# EAGLE schematic cnc (EAGLE 6.4)
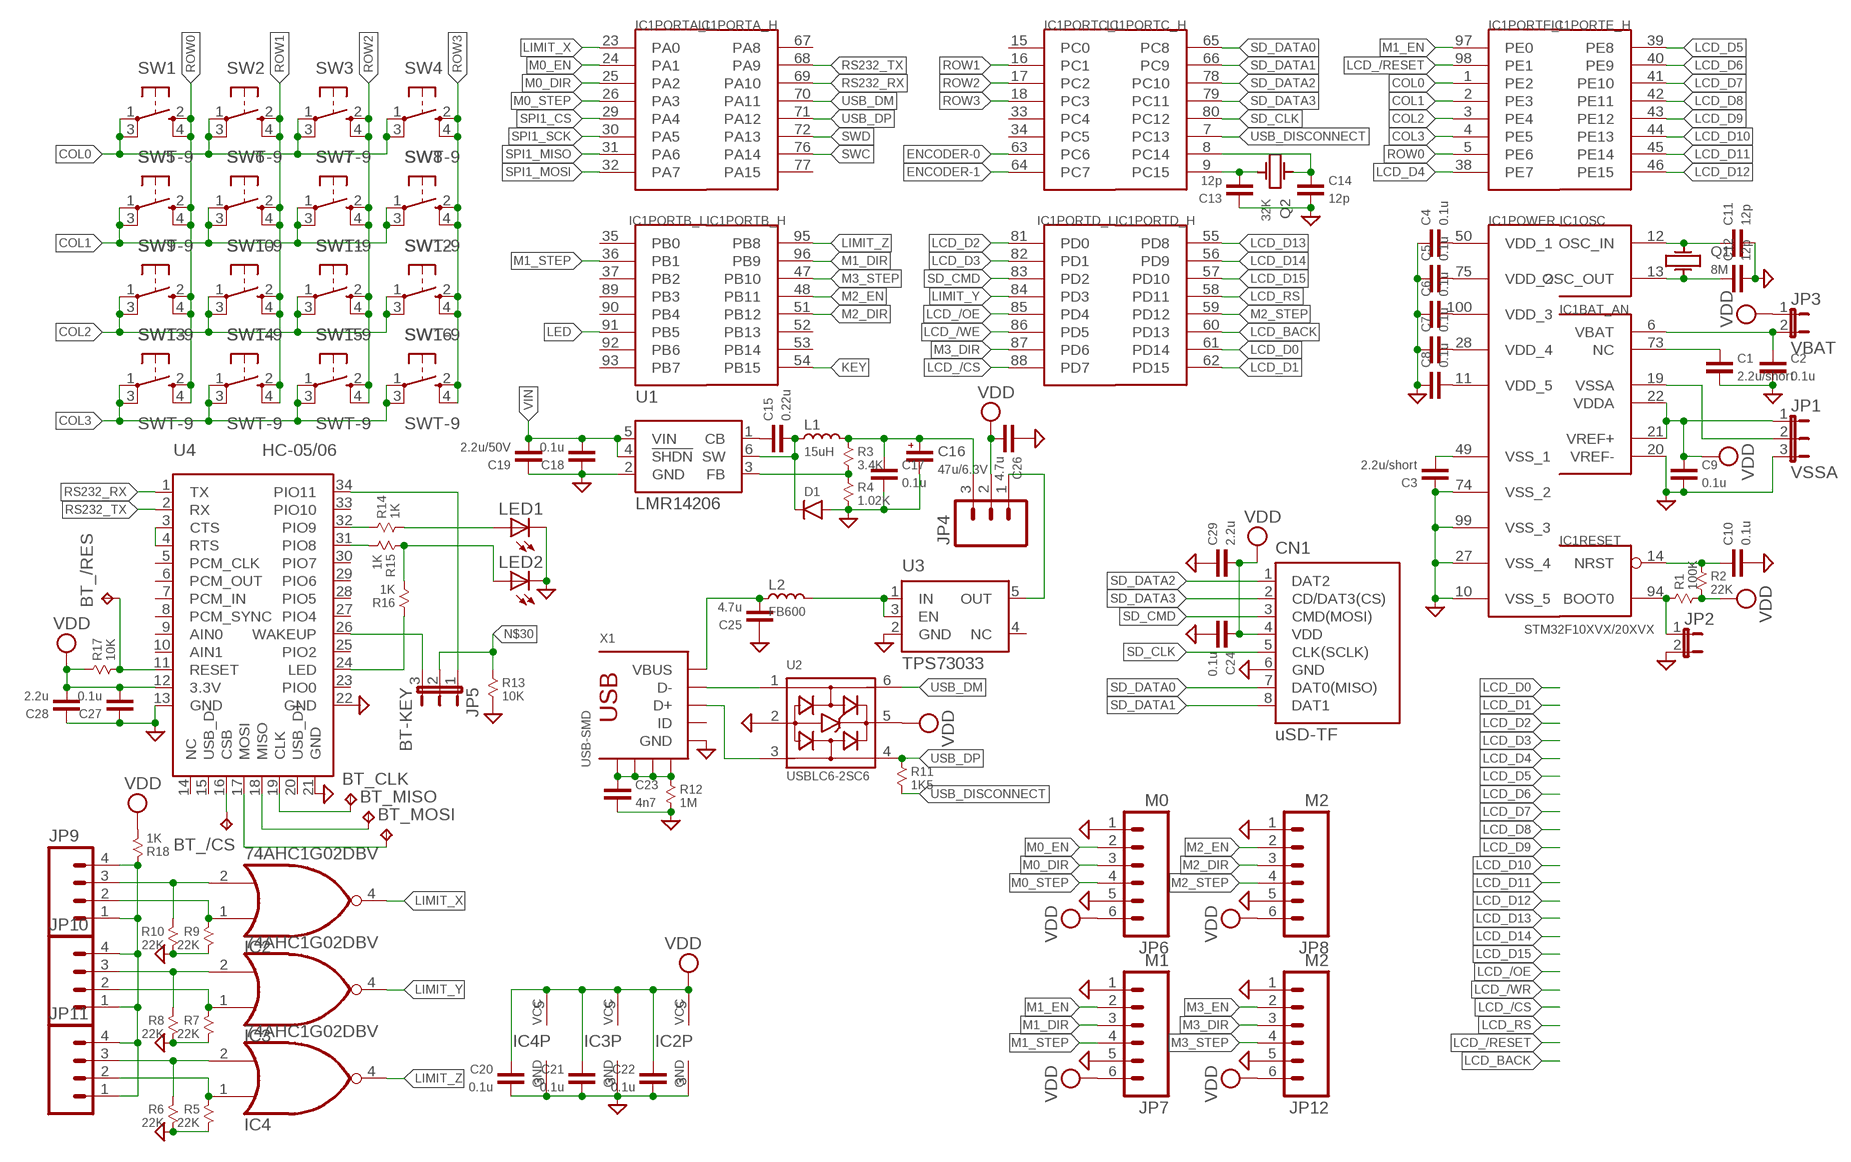
[diagram p0: schematic, sheet 1]

## Parts
BT_/CS  TPTP12R  [TP12R]
BT_/RES  TPTP12R  [TP12R]
BT_CLK  TPTP12R  [TP12R]
BT_MISO  TPTP12R  [TP12R]
BT_MOSI  TPTP12R  [TP12R]
C1  2.2u/short  CAP-0603  [0603]
C2  0.1u  CAP-0603  [0603]
C3  2.2u/short  CAP-0603  [0603]
C4  0.1u  CAP-0603  [0603]
C5  0.1u  CAP-0603  [0603]
C6  0.1u  CAP-0603  [0603]
C7  0.1u  CAP-0603  [0603]
C8  0.1u  CAP-0603  [0603]
C9  0.1u  CAP-0603  [0603]
C10  0.1u  CAP-0603  [0603]
C11  12p  CAP-0603  [0603]
C12  12p  CAP-0603  [0603]
C13  12p  CAP-0603  [0603]
C14  12p  CAP-0603  [0603]
C15  0.22u  CAP-0603  [0603]
C16  47u/6.3V  CAP-POL-3528  [CT3528]
C17  0.1u  CAP-0603  [0603]
C18  0.1u  CAP-0603  [0603]
C19  2.2u/50V  CAP-0805  [0805]
C20  0.1u  CAP-0603  [0603]
C21  0.1u  CAP-0603  [0603]
C22  0.1u  CAP-0603  [0603]
C23  4n7  CAP-0603  [0603]
C24  0.1u  CAP-0603  [0603]
C25  4.7u  CAP-0603  [0603]
C26  4.7u  CAP-0603  [0603]
C27  0.1u  CAP-0603  [0603]
C28  2.2u  CAP-0603  [0603]
C29  2.2u  CAP-0603  [0603]
CN1  uSD-TF  MICRO-SD-T-FLASH  [T-FLASH]
D1  DIODE-SMA  [SMA]
IC1  STM32F10XVX/20XVX  STM32F10XVXT6  [TQFP100]
IC2  74AHC1G02DBV  [SOT23-5]
IC3  74AHC1G02DBV  [SOT23-5]
IC4  74AHC1G02DBV  [SOT23-5]
JP1  VSSA  JUMPER-3SMD  [SJ_3]
JP2  JUMPER-2SMD-NO  [SJ_2S-NO]
JP3  VBAT  JUMPER-2SMD-NO  [SJ_2S-NO]
JP4  M03PTH  [1X03]
JP5  BT-KEY  JUMPER-3SMD  [SJ_3]
JP6  M0  M06SIP  [1X06]
JP7  M1  M06SIP  [1X06]
JP8  M2  M06SIP  [1X06]
JP9  M04PTH  [1X04]
JP10  M04PTH  [1X04]
JP11  M04PTH  [1X04]
JP12  M2  M06SIP  [1X06]
L1  15uH  INDUCTOR-CDRH73-  [CDRH73]
L2  FB600  INDUCTOR-0603  [0603]
LED1  LEDCHIP-LED0603  [CHIP-LED0603]
LED2  LEDCHIP-LED0603  [CHIP-LED0603]
Q1  8M  CRYSTAL-KX-9A  [KX-9A]
Q2  32K  CRYSTAL-X3215  [X3215]
R1  100K  RESISTOR-0603  [0603]
R2  22K  RESISTOR-0603  [0603]
R3  3.4K  RESISTOR-0603  [0603]
R4  1.02K  RESISTOR-0603  [0603]
R5  22K  RESISTOR-0603  [0603]
R6  22K  RESISTOR-0603  [0603]
R7  22K  RESISTOR-0603  [0603]
R8  22K  RESISTOR-0603  [0603]
R9  22K  RESISTOR-0603  [0603]
R10  22K  RESISTOR-0603  [0603]
R11  1K5  RESISTOR-0603  [0603]
R12  1M  RESISTOR-0603  [0603]
R13  10K  RESISTOR-0603  [0603]
R14  1K  RESISTOR-0603  [0603]
R15  1K  RESISTOR-0603  [0603]
R16  1K  RESISTOR-0603  [0603]
R17  10K  RESISTOR-0603  [0603]
R18  1K  RESISTOR-0603  [0603]
SW1  SWT-9  SWITCH-SWT-9  [SWT-9]
SW2  SWT-9  SWITCH-SWT-9  [SWT-9]
SW3  SWT-9  SWITCH-SWT-9  [SWT-9]
SW4  SWT-9  SWITCH-SWT-9  [SWT-9]
SW5  SWT-9  SWITCH-SWT-9  [SWT-9]
SW6  SWT-9  SWITCH-SWT-9  [SWT-9]
SW7  SWT-9  SWITCH-SWT-9  [SWT-9]
SW8  SWT-9  SWITCH-SWT-9  [SWT-9]
SW9  SWT-9  SWITCH-SWT-9  [SWT-9]
SW10  SWT-9  SWITCH-SWT-9  [SWT-9]
SW11  SWT-9  SWITCH-SWT-9  [SWT-9]
SW12  SWT-9  SWITCH-SWT-9  [SWT-9]
SW13  SWT-9  SWITCH-SWT-9  [SWT-9]
SW14  SWT-9  SWITCH-SWT-9  [SWT-9]
SW15  SWT-9  SWITCH-SWT-9  [SWT-9]
SW16  SWT-9  SWITCH-SWT-9  [SWT-9]
U1  LMR14206  [SOT23-6]
U2  USBLC6-2SC6  [SOT23-6]
U3  TPS73033  [SOT23-5]
U4  HC-05/06  SEEDI-BT  [SEEDI-BT]
X1  USB-SMD  [USB-MINIB]

## Nets
3V3: C16.+ C17.2 JP4.3 L1.P$2 R3.1
COL0: IC1.1(PORTE_L:PE2) SW1.1 SW1.3 SW2.1 SW2.3 SW3.1 SW3.3 SW4.1 SW4.3
COL1: IC1.2(PORTE_L:PE3) SW5.1 SW5.3 SW6.1 SW6.3 SW7.1 SW7.3 SW8.1 SW8.3
COL2: IC1.3(PORTE_L:PE4) SW9.1 SW9.3 SW10.1 SW10.3 SW11.1 SW11.3 SW12.1 SW12.3
COL3: IC1.4(PORTE_L:PE5) SW13.1 SW13.3 SW14.1 SW14.3 SW15.1 SW15.3 SW16.1 SW16.3
ENCODER-0: IC1.63(PORTC_L:PC6)
ENCODER-1: IC1.64(PORTC_L:PC7)
GND: C1.1 C2.1 C3.2 C4.2 C5.2 C6.2 C7.2 C8.2 C9.1 C10.1 C11.1 C12.1 C13.2 C14.1 C16.- C17.1 C18.2 C19.2 C20.1 C21.1 C22.1 C23.1 C24.1 C25.2 C26.2 C27.2 C28.2 C29.2 CN1.6(GND) D1.P$2(A) IC1.10(POWER:VSS_5) IC1.20(BAT_AN:VREF-) IC1.27(POWER:VSS_4) IC1.74(POWER:VSS_2) IC1.99(POWER:VSS_3) IC2.3(GND) IC3.3(GND) IC4.3(GND) JP1.3 JP2.2 JP6.1 JP6.5 JP7.1 JP7.5 JP8.1 JP8.5 JP12.1 JP12.5 LED1.C LED2.C R4.2 R5.2 R6.2 R7.2 R8.2 R9.2 R10.2 R12.2 R13.2 U1.2(GND) U2.2(GND) U3.2(GND) U4.13(GND) U4.21(GND) U4.22(GND) X1.GND
KEY: IC1.54(PORTB_H:PB15)
LCD_/CS: IC1.88(PORTD_L:PD7)
LCD_/OE: IC1.85(PORTD_L:PD4)
LCD_/RESET: IC1.98(PORTE_L:PE1)
LCD_/WE: IC1.86(PORTD_L:PD5)
LCD_BACK: IC1.60(PORTD_H:PD13)
LCD_D0: IC1.61(PORTD_H:PD14)
LCD_D1: IC1.62(PORTD_H:PD15)
LCD_D2: IC1.81(PORTD_L:PD0)
LCD_D3: IC1.82(PORTD_L:PD1)
LCD_D4: IC1.38(PORTE_L:PE7)
LCD_D5: IC1.39(PORTE_H:PE8)
LCD_D6: IC1.40(PORTE_H:PE9)
LCD_D7: IC1.41(PORTE_H:PE10)
LCD_D8: IC1.42(PORTE_H:PE11)
LCD_D9: IC1.43(PORTE_H:PE12)
LCD_D10: IC1.44(PORTE_H:PE13)
LCD_D11: IC1.45(PORTE_H:PE14)
LCD_D12: IC1.46(PORTE_H:PE15)
LCD_D13: IC1.55(PORTD_H:PD8)
LCD_D14: IC1.56(PORTD_H:PD9)
LCD_D15: IC1.57(PORTD_H:PD10)
LCD_RS: IC1.58(PORTD_H:PD11)
LED: IC1.91(PORTB_L:PB5)
LIMIT_X: IC1.23(PORTA_L:PA0) IC2.4(O)
LIMIT_Y: IC1.84(PORTD_L:PD3) IC3.4(O)
LIMIT_Z: IC1.95(PORTB_H:PB8) IC4.4(O)
M0_DIR: IC1.25(PORTA_L:PA2) JP6.3
M0_EN: IC1.24(PORTA_L:PA1) JP6.2
M0_STEP: IC1.26(PORTA_L:PA3) JP6.4
M1_DIR: IC1.96(PORTB_H:PB9) JP7.3
M1_EN: IC1.97(PORTE_L:PE0) JP7.2
M1_STEP: IC1.36(PORTB_L:PB1) JP7.4
M2_DIR: IC1.51(PORTB_H:PB12) JP8.3
M2_EN: IC1.48(PORTB_H:PB11) JP8.2
M2_STEP: IC1.59(PORTD_H:PD12) JP8.4
M3_DIR: IC1.87(PORTD_L:PD6) JP12.3
M3_EN: JP12.2
M3_STEP: IC1.47(PORTB_H:PB10) JP12.4
MAX-X: IC2.1(I0) JP9.2 R9.1
MAX-Y: IC3.1(I0) JP10.2 R7.1
MAX-Z: IC4.1(I0) JP11.2 R5.1
MIN-X: IC2.2(I1) JP9.3 R10.1
MIN-Y: IC3.2(I1) JP10.3 R8.1
MIN-Z: IC4.2(I1) JP11.3 R6.1
N$1: C4.1 IC1.50(POWER:VDD_1)
N$2: C5.1 IC1.75(POWER:VDD_2)
N$3: C6.1 IC1.100(POWER:VDD_3)
N$4: C7.1 IC1.28(POWER:VDD_4)
N$5: C8.1 IC1.11(POWER:VDD_5)
N$6: IC1.19(BAT_AN:VSSA) JP1.2
N$7: C3.1 IC1.49(POWER:VSS_1)
N$8: C1.2 IC1.73(BAT_AN:NC)
N$9: C11.2 IC1.12(OSC:OSC_IN) Q1.1
N$10: C2.2 IC1.6(BAT_AN:VBAT) JP3.2
N$11: IC1.94(RESET:BOOT0) JP2.1 R1.1
N$12: C12.2 IC1.13(OSC:OSC_OUT) Q1.3
N$13: C10.2 IC1.14(RESET:NRST) R2.1
N$14: U2.1(IO1) X1.D-
N$15: C14.2 IC1.8(PORTC_H:PC14) Q2.1
N$16: C13.1 IC1.9(PORTC_H:PC15) Q2.2
N$17: C15.2 U1.1(CB)
N$18: R3.2 R4.1 U1.3(FB)
N$19: C15.1 D1.P$1(C) L1.P$1 U1.6(SW)
N$20: U2.3(IO2) X1.D+
N$21: U4.3(CTS) U4.4(RTS)
N$22: C23.2 R12.1 X1.GND@1(GND) X1.GND@2(GND) X1.GND@3(GND) X1.GND@4(GND)
N$23: JP4.1 U3.5(OUT)
N$24: L2.2 U3.1(IN) U3.3(EN)
N$25: JP5.1 U4.34(PIO11)
N$26: R14.1 U4.32(PIO9)
N$27: R15.2 U4.31(PIO8)
N$28: R16.1 U4.24(LED)
N$29: JP5.3 U4.26(WAKEUP)
N$30: JP5.2 R13.1
N$31: LED2.A R15.1 R16.2
N$32: LED1.A R14.2
N$33: JP9.1 JP9.4 JP10.1 JP10.4 JP11.1 JP11.4 R18.1
N$34: BT_/CS.TP U4.16(CSB)
N$35: BT_/RES.TP R17.2 U4.11(RESET)
N$36: BT_MOSI.TP U4.17(MOSI)
N$37: BT_MISO.TP U4.18(MISO)
N$38: BT_CLK.TP U4.19(CLK)
ROW0: IC1.5(PORTE_L:PE6) SW1.2 SW1.4 SW5.2 SW5.4 SW9.2 SW9.4 SW13.2 SW13.4
ROW1: IC1.16(PORTC_L:PC1) SW2.2 SW2.4 SW6.2 SW6.4 SW10.2 SW10.4 SW14.2 SW14.4
ROW2: IC1.17(PORTC_L:PC2) SW3.2 SW3.4 SW7.2 SW7.4 SW11.2 SW11.4 SW15.2 SW15.4
ROW3: IC1.18(PORTC_L:PC3) SW4.2 SW4.4 SW8.2 SW8.4 SW12.2 SW12.4 SW16.2 SW16.4
RS232_RX: IC1.69(PORTA_H:PA10) U4.1(TX)
RS232_TX: IC1.68(PORTA_H:PA9) U4.2(RX)
SD_CLK: IC1.80(PORTC_H:PC12)
SD_CMD: IC1.83(PORTD_L:PD2)
SD_DATA0: IC1.65(PORTC_H:PC8)
SD_DATA1: IC1.66(PORTC_H:PC9)
SD_DATA2: IC1.78(PORTC_H:PC10)
SD_DATA3: IC1.79(PORTC_H:PC11)
SPI1_CS: IC1.29(PORTA_L:PA4)
SPI1_MISO: IC1.31(PORTA_L:PA6)
SPI1_MOSI: IC1.32(PORTA_L:PA7)
SPI1_SCK: IC1.30(PORTA_L:PA5)
SWC: IC1.76(PORTA_H:PA14)
SWD: IC1.72(PORTA_H:PA13)
USB_DISCONNECT: IC1.7(PORTC_H:PC13) R11.2
USB_DM: IC1.70(PORTA_H:PA11) U2.6(IO1)
USB_DP: IC1.71(PORTA_H:PA12) R11.1 U2.4(IO2)
VDD: C9.2 C20.2 C21.2 C22.2 C24.2 C26.1 C27.1 C28.1 C29.1 CN1.4(VDD) IC1.21(BAT_AN:VREF+) IC1.22(BAT_AN:VDDA) IC2.5(VCC) IC3.5(VCC) IC4.5(VCC) JP1.1 JP3.1 JP4.2 JP6.6 JP7.6 JP8.6 JP12.6 R1.2 R2.2 R17.1 R18.2 U2.5(VBUS) U4.12(3.3V)
VIN: C18.1 C19.1 U1.4(!SHDN) U1.5(VIN)
VUSB: C25.1 L2.1 X1.VBUS
Unconnected: CN1.1(DAT2) CN1.2(CD/DAT3(CS)) CN1.3(CMD(MOSI)) CN1.5(CLK(SCLK)) CN1.7(DAT0(MISO)) CN1.8(DAT1) IC1.15(PORTC_L:PC0) IC1.33(PORTC_L:PC4) IC1.34(PORTC_L:PC5) IC1.35(PORTB_L:PB0) IC1.37(PORTB_L:PB2) IC1.52(PORTB_H:PB13) IC1.53(PORTB_H:PB14) IC1.67(PORTA_H:PA8) IC1.77(PORTA_H:PA15) IC1.89(PORTB_L:PB3) IC1.90(PORTB_L:PB4) IC1.92(PORTB_L:PB6) IC1.93(PORTB_L:PB7) U3.4(NC) U4.5(PCM_CLK) U4.6(PCM_OUT) U4.7(PCM_IN) U4.8(PCM_SYNC) U4.9(AIN0) U4.10(AIN1) U4.14(NC) U4.15(USB_D-) U4.20(USB_D+) U4.23(PIO0) U4.25(PIO2) U4.27(PIO4) U4.28(PIO5) U4.29(PIO6) U4.30(PIO7) U4.33(PIO10) X1.ID

## Library data of the parts
BT_/CS BT_/RES BT_CLK BT_MISO BT_MOSI = testpad:TP: Test pad
C1-C15 C17-C29 = X893:CAP: Capacitor
C16 = X893:CAP-POL
CN1 = X893:MICRO-SD
D1 = X893:DIODE
IC1 = stm32:STM32F10XVXT6: STM32F101/103 100 pin LQFP
IC2-IC4 = 74xx-little-us:74*1G02: 2-input NOR gate
JP1 JP5 = SparkFun:JUMPER-3
JP2 JP3 = SparkFun:JUMPER-2: Jumper Basic 0.1" spaced jumper. Use with breakaway headers.
JP4 = SparkFun:M03: Header 3 Standard 3-pin 0.1" header. Use with straight break away headers (SKU : PRT-00116), right angle break away headers (PRT-00553), swiss pins (PRT-00743), machine pins (PRT-00117), and female headers (PRT-00115). Molex polarized connector foot print use with SKU : PRT-08232 with associated crimp pins and housings.
JP6-JP8 JP12 = SparkFun:M06: Header 6 Standard 6-pin 0.1" header. Use with straight break away headers (SKU : PRT-00116), right angle break away headers (PRT-00553), swiss pins (PRT-00743), machine pins (PRT-00117), and female headers (PRT-00115). Molex polarized connector foot print use with SKU : PRT-08094 with associated crimp pins and housings. NOTES ON THE VARIANTS LOCK and LOCK_LONGPADS... This footprint was designed to help hold the alignment of a through-hole component (i.e. 6-pin header) while soldering it into place. You may notice that each hole has been shifted either up or down by 0.005 of an inch from it's more standard position (which is a perfectly straight line). This slight alteration caused the pins (the squares in the middle) to touch the edges of the holes. Because they are alternating, it causes a "brace" to hold the component in place. 0.005 has proven to be the perfect amount of "off-center" position when using our standard breakaway headers. Although looks a little odd when you look at the bare footprint, once you have a header in there, the alteration is very hard to notice. Also, if you push a header all the way into place, it is covered up entirely on the bottom side. This idea of altering the position of holes to aid alignment will be further integrated into the Sparkfun Library for other footprints. It can help hold any component with 3 or more connection pins.
JP9-JP11 = SparkFun:M04: Header 4 Standard 4-pin 0.1" header. Use with straight break away headers (SKU : PRT-00116), right angle break away headers (PRT-00553), swiss pins (PRT-00743), machine pins (PRT-00117), and female headers (PRT-00115). Molex polarized connector foot print use with SKU : PRT-08231 with associated crimp pins and housings.
L1 L2 = X893:INDUCTOR: http://www.murata.com/products/catalog/pdf/o05e.pdf
LED1 LED2 = led:LED: LED OSRAM: - CHIPLED LG R971, LG N971, LY N971, LG Q971, LY Q971, LO R971, LY R971 LH N974, LH R974 LS Q976, LO Q976, LY Q976 LO Q996 - Hyper CHIPLED LW Q18S LB Q993, LB Q99A, LB R99A - SideLED LS A670, LO A670, LY A670, LG A670, LP A670 LB A673, LV A673, LT A673, LW A673 LH A674 LY A675 LS A676, LA A676, LO A676, LY A676, LW A676 LS A679, LY A679, LG A679 - Hyper Micro SIDELED® LS Y876, LA Y876, LO Y876, LY Y876 LT Y87S - SmartLED LW L88C, LW L88S LB L89C, LB L89S, LG L890 LS L89K, LO L89K, LY L89K LS L896, LA L896, LO L896, LY L896 - TOPLED LS T670, LO T670, LY T670, LG T670, LP T670 LSG T670, LSP T670, LSY T670, LOP T670, LYG T670 LG T671, LOG T671, LSG T671 LB T673, LV T673, LT T673, LW T673 LH T674 LS T676, LA T676, LO T676, LY T676, LB T676, LH T676, LSB T676, LW T676 LB T67C, LV T67C, LT T67C, LS T67K, LO T67K, LY T67K, LW E67C LS E67B, LA E67B, LO E67B, LY E67B, LB E67C, LV E67C, LT E67C LW T67C LS T679, LY T679, LG T679 LS T770, LO T770, LY T770, LG T770, LP T770 LB T773, LV T773, LT T773, LW T773 LH T774 LS E675, LA E675, LY E675, LS T675 LS T776, LA T776, LO T776, LY T776, LB T776 LHGB T686 LT T68C, LB T68C - Hyper Mini TOPLED® LB M676 - Mini TOPLED Santana® LG M470 LS M47K, LO M47K, LY M47K Source: http://www.osram.convergy.de LUXEON: - LUMILED® LXK2-PW12-R00, LXK2-PW12-S00, LXK2-PW14-U00, LXK2-PW14-V00 LXK2-PM12-R00, LXK2-PM12-S00, LXK2-PM14-U00 LXK2-PE12-Q00, LXK2-PE12-R00, LXK2-PE12-S00, LXK2-PE14-T00, LXK2-PE14-U00 LXK2-PB12-K00, LXK2-PB12-L00, LXK2-PB12-M00, LXK2-PB14-N00, LXK2-PB14-P00, LXK2-PB14-Q00 LXK2-PR12-L00, LXK2-PR12-M00, LXK2-PR14-Q00, LXK2-PR14-R00 LXK2-PD12-Q00, LXK2-PD12-R00, LXK2-PD12-S00 LXK2-PH12-R00, LXK2-PH12-S00 LXK2-PL12-P00, LXK2-PL12-Q00, LXK2-PL12-R00 Source: www.luxeon.com KINGBRIGHT: KA-3528ASYC Source: www.kingbright.com
Q1 Q2 = X893:CRYSTAL: Crystal
R1-R18 = X893:RESISTOR
SW1-SW16 = X893:SWITCH
U1 = X893:LMR14206: SIMPLE SWITCHER 42Vin, 0.6A Step-Down Voltage Regulator in SOT-23 www.ti.com/lit/ds/symlink/lmr14206.pdf
U2 = X893:USBLC6: http://www.terraelectronica.ru/pdf/ST/USBLC6-2SC6.pdf
U3 = X893:TPS73033: LOW-NOISE, HIGH PSRR, RF 200-mA LOW-DROPOUT LINEAR REGULATOR http://www.terraelectronica.ru/pdf/TI/TPS73033.pdf
U4 = X893:SEEDI-BT: Serial port bluetooth module http://www.seeedstudio.com/depot/serial-port-bluetooth-module-masterslave-p-572.html?cPath=2
X1 = X893:USB: USB Connectors USB-B-PTH is fully proven SKU : PRT-00139 USB-miniB is fully proven SKU : PRT-00587 USB-A-PCB is untested. USB-A-H is throughly reviewed, but untested. Spark Fun Electronics SKU : PRT-00437 USB-B-SMT is throughly reviewed, but untested. Needs silkscreen touching up. USB-A-S has not been used/tested USB-MB-H has not been used/tested